# Altium schematic sheet DEMO.SchDoc
size A4
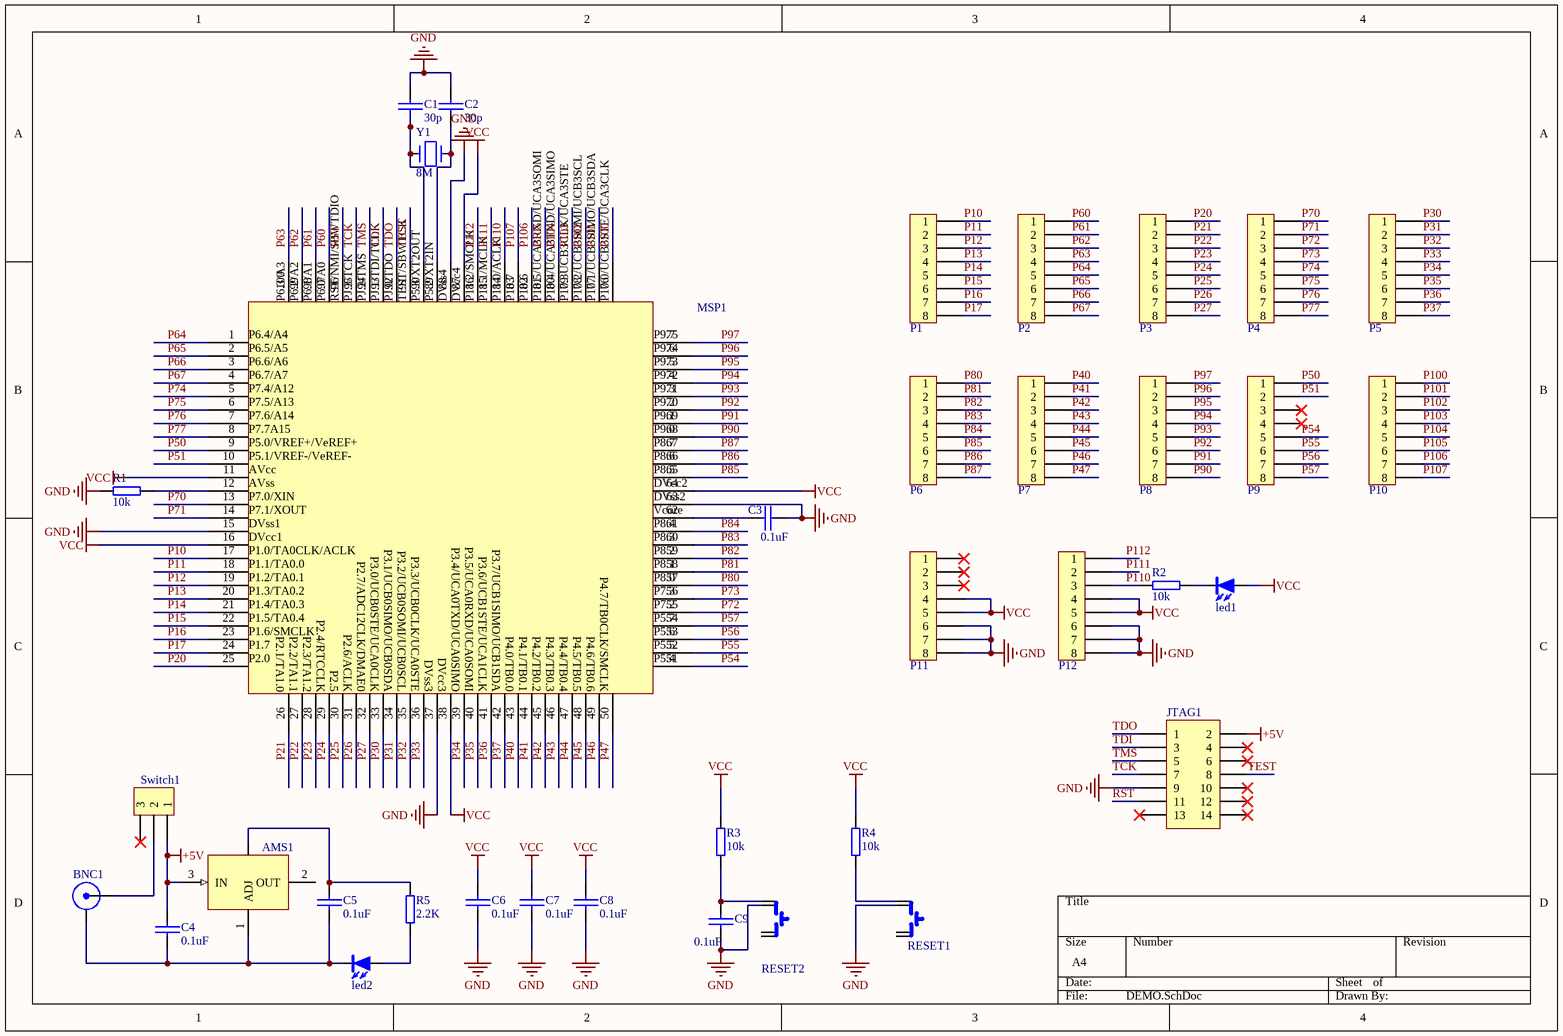
[diagram p0: DEMO.SchDoc]

## Parts
AMS1  1117  [SOT-223/P2.3]  (value not drawn)
BNC1  BNC  [POWER0]  (value not drawn)
C1  30p  [0805]
C2  30p  [0805]
C3  0.1uF  [0805]
C4  0.1uF  [0805]
C5  0.1uF  [0805]
C6  0.1uF  [0805]
C7  0.1uF  [0805]
C8  0.1uF  [0805]
C9  0.1uF  [0805]
JTAG1  Header 7X2  [IDC14A]  (value not drawn)
led1  LED2  [0805]  (value not drawn)
led2  LED2  [0805]  (value not drawn)
MSP1  MSP430F5438  [TQFP100]  (value not drawn)
P1  CON8  [SIP8]  (value not drawn)
P2  CON8  [SIP8]  (value not drawn)
P3  CON8  [SIP8]  (value not drawn)
P4  CON8  [SIP8]  (value not drawn)
P5  CON8  [SIP8]  (value not drawn)
P6  CON8  [SIP8]  (value not drawn)
P7  CON8  [SIP8]  (value not drawn)
P8  CON8  [SIP8]  (value not drawn)
P9  CON8  [SIP8]  (value not drawn)
P10  CON8  [SIP8]  (value not drawn)
P11  CON8  [SIP8]  (value not drawn)
P12  CON8  [SIP8]  (value not drawn)
R1  10k  [0805]
R2  10k  [0805]
R3  10k  [0805]
R4  10k  [0805]
R5  2.2K  [0805]
RESET1  KEY2  [KEY0.2']  (value not drawn)
RESET2  KEY2  [KEY0.2']  (value not drawn)
Switch1  CON3  [5脚船型开关]  (value not drawn)
Y1  8M  [CY1]

## Nets
+5V: AMS1.3(IN) C4.1 JTAG1.2 Switch1.1
GND: C1.1 C2.1 C3.1 C6.2 C7.2 C8.2 C9.2 JTAG1.9 MSP1.15 MSP1.37 MSP1.63 MSP1.88 P11.6 P11.7 P11.8 P12.6 P12.7 P12.8 R1.1 RESET1.4 RESET2.4
VCC: C6.1 C7.1 C8.1 led1.1 MSP1.11 MSP1.16 MSP1.38 MSP1.64 MSP1.87 P11.4 P11.5 P12.4 P12.5 R3.2 R4.2
P10: MSP1.17 P1.1
P11: MSP1.18 P1.2
P12: MSP1.19 P1.3
P13: MSP1.20 P1.4
P14: MSP1.21 P1.5
P15: MSP1.22 P1.6
P16: MSP1.23 P1.7
P17: MSP1.24 P1.8
P20: MSP1.25 P3.1
P21: MSP1.26 P3.2
P22: MSP1.27 P3.3
P23: MSP1.28 P3.4
P24: MSP1.29 P3.5
P25: MSP1.30 P3.6
P26: MSP1.31 P3.7
P27: MSP1.32 P3.8
P30: MSP1.33 P5.1
P31: MSP1.34 P5.2
P32: MSP1.35 P5.3
P33: MSP1.36 P5.4
P34: MSP1.39 P5.5
P35: MSP1.40 P5.6
P36: MSP1.41 P5.7
P37: MSP1.42 P5.8
P40: MSP1.43 P7.1
P41: MSP1.44 P7.2
P42: MSP1.45 P7.3
P43: MSP1.46 P7.4
P44: MSP1.47 P7.5
P45: MSP1.48 P7.6
P46: MSP1.49 P7.7
P47: MSP1.50 P7.8
P50: MSP1.9 P9.1
P51: MSP1.10 P9.2
P54: MSP1.51 P9.5
P55: MSP1.52 P9.6
P56: MSP1.53 P9.7
P57: MSP1.54 P9.8
P60: MSP1.97 P2.1
P61: MSP1.98 P2.2
P62: MSP1.99 P2.3
P63: MSP1.100 P2.4
P64: MSP1.1 P2.5
P65: MSP1.2 P2.6
P66: MSP1.3 P2.7
P67: MSP1.4 P2.8
P70: MSP1.13 P4.1
P71: MSP1.14 P4.2
P72: MSP1.55 P4.3
P73: MSP1.56 P4.4
P74: MSP1.5 P4.5
P75: MSP1.6 P4.6
P76: MSP1.7 P4.7
P77: MSP1.8 P4.8
P80: MSP1.57 P6.1
P81: MSP1.58 P6.2
P82: MSP1.59 P6.3
P83: MSP1.60 P6.4
P84: MSP1.61 P6.5
P85: MSP1.65 P6.6
P86: MSP1.66 P6.7
P87: MSP1.67 P6.8
P90: MSP1.68 P8.8
P91: MSP1.69 P8.7
P92: MSP1.70 P8.6
P93: MSP1.71 P8.5
P94: MSP1.72 P8.4
P95: MSP1.73 P8.3
P96: MSP1.74 P8.2
P97: MSP1.75 P8.1
P100: MSP1.76 P10.1
P101: MSP1.77 P10.2
P102: MSP1.78 P10.3
P103: MSP1.79 P10.4
P104: MSP1.80 P10.5
P105: MSP1.81 P10.6
P106: MSP1.82 P10.7
P107: MSP1.83 P10.8
P110: MSP1.84 P12.3 R2.1
P111: MSP1.85 P12.2
P112: MSP1.86 P12.1
RST: JTAG1.11 MSP1.96
TCK: JTAG1.7 MSP1.95
TDI: JTAG1.3 MSP1.93
TDO: JTAG1.1 MSP1.92
TEST: JTAG1.8 MSP1.91
TMS: JTAG1.5 MSP1.94
NetAMS1_1: AMS1.1(ADJ) BNC1.2 C4.2 C5.2 led2.2
NetAMS1_4: AMS1.4 C5.1 R5.2
NetBNC1_1: BNC1.1 Switch1.2
NetC1_2: C1.2 MSP1.90 Y1.1
NetC2_2: C2.2 MSP1.89 Y1.2
NetC3_2: C3.2 MSP1.62
NetC9_1: C9.1 R3.1 RESET2.3
Netled1_2: led1.2 R2.2
Netled2_1: led2.1 R5.1
NetMSP1_12: MSP1.12 R1.2
NetR4_1: R4.1 RESET1.3

Not connected (* = marked no-connect by the designer): AMS1 2(OUT); JTAG1 4* 6* 10* 12* 13* 14*; P9 3* 4*; P11 1* 2* 3*; RESET1 1 2; RESET2 1 2; Switch1 3*

## Notes on the sheet
- (in symbol MSP430F5438) P6.3/A3; P6.2/A2; P6.1/A1; P6.0/A0; RST/NMI/SBWTDIO; PJ.3/TCK; PJ.2/TMS; PJ.1/TDI/TCLK; PJ.0/TDO; TEST/SBWTCK; P5.3/XT2OUT; P5.2/XT2IN; DVss4; DVcc4; P11.2/SMCLK; P11.1/MCLK; P11.0/ACLK; P10.7; P10.6; P10.5/UCA3RXD/UCA3SOMI; P10.4/UCA3TXD/UCA3SIMO; P10.3UCB3CLK/UCA3STE; P10.2/UCB3SOMI/UCB3SCL; P10.1/UCB3SIMO/UCB3SDA; P10.0/UCB3STE/UCA3CLK; P6.4/A4; P9.7; P6.5/A5; P9.6; P6.6/A6; P9.5; P6.7/A7; P9.4; P7.4/A12; P9.3; P7.5/A13; P9.2; P7.6/A14; P9.1; P7.7A15; P9.0; P5.0/VREF+/VeREF+; P8.7; P5.1/VREF-/VeREF-; P8.6; AVcc; P8.5; AVss; DVcc2; P7.0/XIN; DVss2; P7.1/XOUT; Vcore; DVss1; P8.4; DVcc1; P8.3; P1.0/TA0CLK/ACLK; P8.2; P1.1/TA0.0; P8.1; P1.2/TA0.1; P8.0; P1.3/TA0.2; P7.3; P1.4/TA0.3; P7.2; P1.5/TA0.4; P5.7; P1.6/SMCLK; P5.6; P1.7; P5.5; P2.0; P5.4; P2.1/TA1.0; P2.2/TA1.1; P2.3/TA1.2; P2.4/RTCCLK; P2.5; P2.6/ACLK; P2.7/ADC12CLK/DMAE0; P3.0/UCB0STE/UCA0CLK; P3.1/UCB0SIMO/UCB0SDA; P3.2/UCB0SOMI/UCB0SCL; P3.3/UCB0CLK/UCA0STE; DVss3; DVcc3; P3.4/UCA0TXD/UCA0SIMO; P3.5/UCA0RXD/UCA0SOMI; P3.6/UCB1STE/UCA1CLK; P3.7/UCB1SIMO/UCB1SDA; P4.0/TB0.0; P4.1/TB0.1; P4.2/TB0.2; P4.3/TB0.3; P4.4/TB0.4; P4.5/TB0.5; P4.6/TB0.6; P4.7/TB0CLK/SMCLK

## Library data of the parts
C1-C9 = C1: 0.1: *; 0.01: *; 0.47: *; 0.22: *; 0.022: *; 2.2n: *; 1n: *
JTAG1 = Header 7X2: Header, 7-Pin, Dual row; Revision: 17-Jul-2002: Re-released for DXP Platform.; Publisher: Altium Limited
R1-R5 = R1
Y1 = CY1